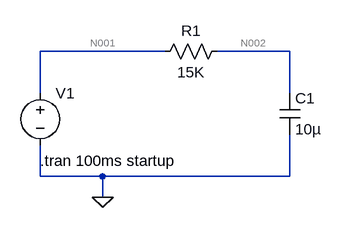
[diagram p0: schematic Objective2.2.asc]
Objective2.2.asc, the LTspice schematic file:
Version 4
SHEET 1 880 680
WIRE 144 80 -48 80
WIRE 336 80 224 80
WIRE -48 144 -48 80
WIRE 336 144 336 80
WIRE -48 272 -48 224
WIRE 48 272 -48 272
WIRE 336 272 336 208
WIRE 336 272 48 272
WIRE 48 304 48 272
FLAG 48 304 0
SYMBOL res 240 64 R90
WINDOW 0 0 56 VBottom 2
WINDOW 3 32 56 VTop 2
SYMATTR InstName R1
SYMATTR Value 15K
SYMBOL cap 320 144 R0
SYMATTR InstName C1
SYMATTR Value 10µ
SYMBOL voltage -48 128 R0
WINDOW 123 0 0 Left 0
WINDOW 39 0 0 Left 0
SYMATTR InstName V1
SYMATTR Value ""
TEXT -48 248 Left 2 !.tran 100ms startup

The netlist it stands for:
* Objective2.2.asc
R1 N002 N001 15K
C1 N002 0 10µ
V1 N001 0
.tran 100ms startup
.backanno
.end

* Results of the author's LTspice run, read from the files saved beside the schematic
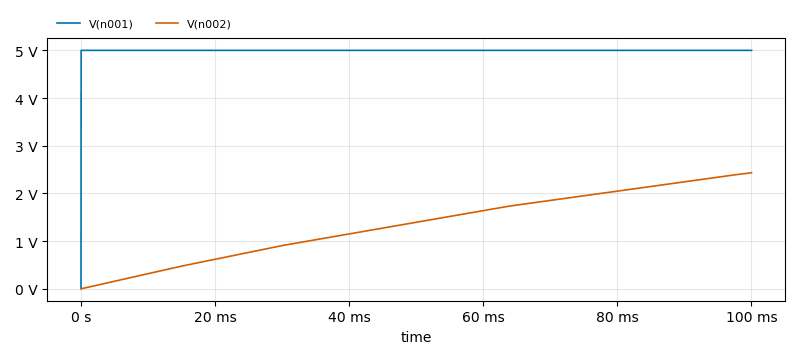
[diagram p1: Transient Analysis of Objective2.2.asc, plotted from the saved traces]
* Transient Analysis, 1 run:
*   V(n001): min 0 V, max 5 V, average 4.999 V, rms 5 V, last 5 V
*   V(n002): min 0 V, max 2.433 V, average 1.34 V, rms 1.534 V, last 2.433 V